# Altium schematic sheet LEDs.SchDoc
size B
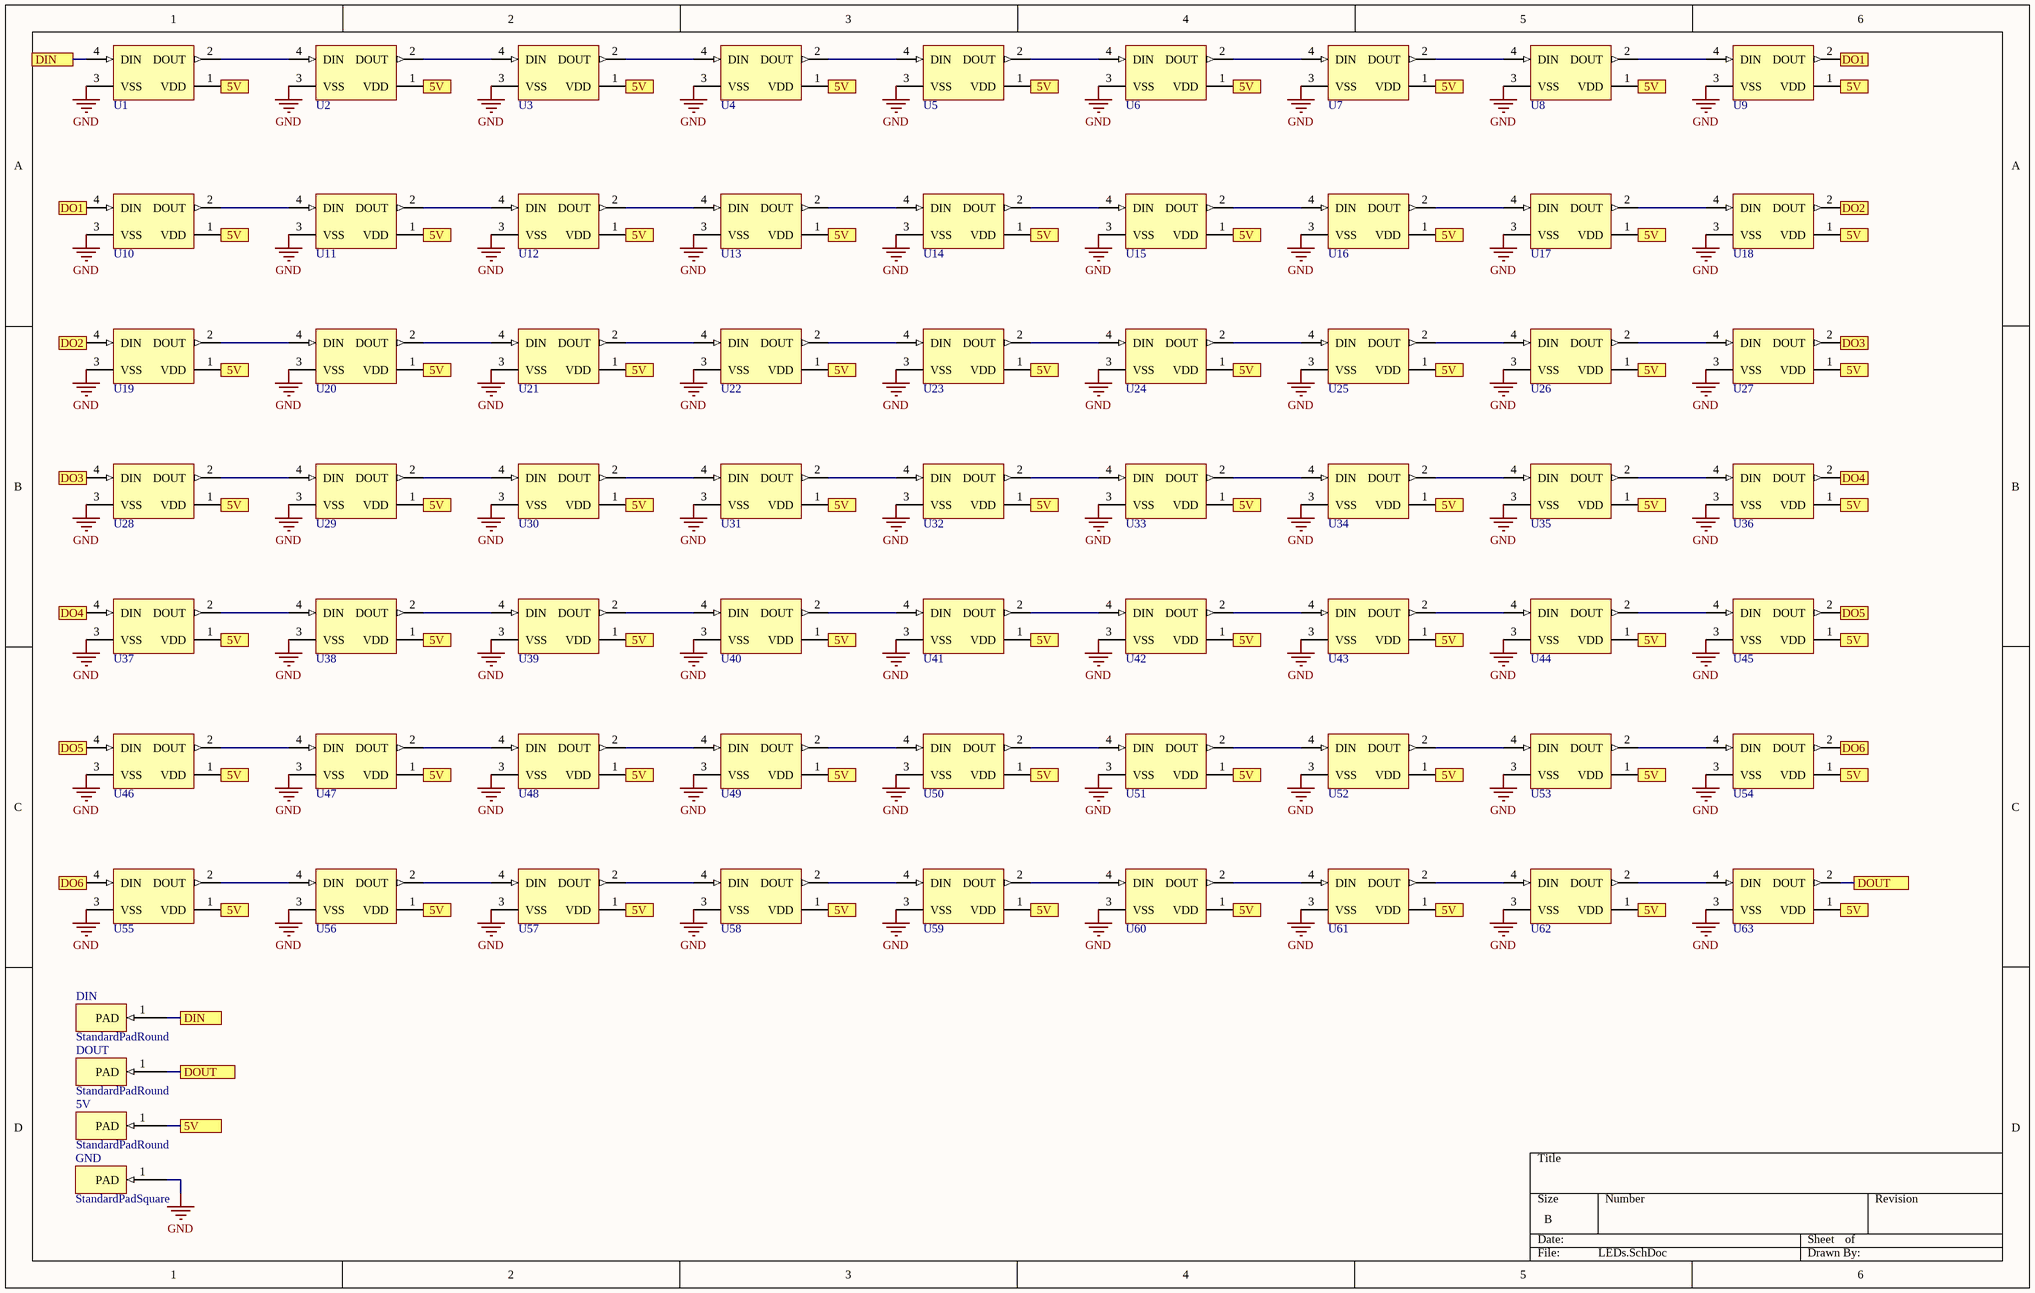
[diagram p0: LEDs.SchDoc]

## Parts
5V  StandardPadRound  [StandardPadRound-Footprint-1]
DIN  StandardPadRound  [StandardPadRound-Footprint-1]
DOUT  StandardPadRound  [StandardPadRound-Footprint-1]
GND  StandardPadSquare  [StandardPadSquare-Footprint-1]
U1  WS2812B  [WS2812B-Footprint-1]  (value not drawn)
U2  WS2812B  [WS2812B-Footprint-1]  (value not drawn)
U3  WS2812B  [WS2812B-Footprint-1]  (value not drawn)
U4  WS2812B  [WS2812B-Footprint-1]  (value not drawn)
U5  WS2812B  [WS2812B-Footprint-1]  (value not drawn)
U6  WS2812B  [WS2812B-Footprint-1]  (value not drawn)
U7  WS2812B  [WS2812B-Footprint-1]  (value not drawn)
U8  WS2812B  [WS2812B-Footprint-1]  (value not drawn)
U9  WS2812B  [WS2812B-Footprint-1]  (value not drawn)
U10  WS2812B  [WS2812B-Footprint-1]  (value not drawn)
U11  WS2812B  [WS2812B-Footprint-1]  (value not drawn)
U12  WS2812B  [WS2812B-Footprint-1]  (value not drawn)
U13  WS2812B  [WS2812B-Footprint-1]  (value not drawn)
U14  WS2812B  [WS2812B-Footprint-1]  (value not drawn)
U15  WS2812B  [WS2812B-Footprint-1]  (value not drawn)
U16  WS2812B  [WS2812B-Footprint-1]  (value not drawn)
U17  WS2812B  [WS2812B-Footprint-1]  (value not drawn)
U18  WS2812B  [WS2812B-Footprint-1]  (value not drawn)
U19  WS2812B  [WS2812B-Footprint-1]  (value not drawn)
U20  WS2812B  [WS2812B-Footprint-1]  (value not drawn)
U21  WS2812B  [WS2812B-Footprint-1]  (value not drawn)
U22  WS2812B  [WS2812B-Footprint-1]  (value not drawn)
U23  WS2812B  [WS2812B-Footprint-1]  (value not drawn)
U24  WS2812B  [WS2812B-Footprint-1]  (value not drawn)
U25  WS2812B  [WS2812B-Footprint-1]  (value not drawn)
U26  WS2812B  [WS2812B-Footprint-1]  (value not drawn)
U27  WS2812B  [WS2812B-Footprint-1]  (value not drawn)
U28  WS2812B  [WS2812B-Footprint-1]  (value not drawn)
U29  WS2812B  [WS2812B-Footprint-1]  (value not drawn)
U30  WS2812B  [WS2812B-Footprint-1]  (value not drawn)
U31  WS2812B  [WS2812B-Footprint-1]  (value not drawn)
U32  WS2812B  [WS2812B-Footprint-1]  (value not drawn)
U33  WS2812B  [WS2812B-Footprint-1]  (value not drawn)
U34  WS2812B  [WS2812B-Footprint-1]  (value not drawn)
U35  WS2812B  [WS2812B-Footprint-1]  (value not drawn)
U36  WS2812B  [WS2812B-Footprint-1]  (value not drawn)
U37  WS2812B  [WS2812B-Footprint-1]  (value not drawn)
U38  WS2812B  [WS2812B-Footprint-1]  (value not drawn)
U39  WS2812B  [WS2812B-Footprint-1]  (value not drawn)
U40  WS2812B  [WS2812B-Footprint-1]  (value not drawn)
U41  WS2812B  [WS2812B-Footprint-1]  (value not drawn)
U42  WS2812B  [WS2812B-Footprint-1]  (value not drawn)
U43  WS2812B  [WS2812B-Footprint-1]  (value not drawn)
U44  WS2812B  [WS2812B-Footprint-1]  (value not drawn)
U45  WS2812B  [WS2812B-Footprint-1]  (value not drawn)
U46  WS2812B  [WS2812B-Footprint-1]  (value not drawn)
U47  WS2812B  [WS2812B-Footprint-1]  (value not drawn)
U48  WS2812B  [WS2812B-Footprint-1]  (value not drawn)
U49  WS2812B  [WS2812B-Footprint-1]  (value not drawn)
U50  WS2812B  [WS2812B-Footprint-1]  (value not drawn)
U51  WS2812B  [WS2812B-Footprint-1]  (value not drawn)
U52  WS2812B  [WS2812B-Footprint-1]  (value not drawn)
U53  WS2812B  [WS2812B-Footprint-1]  (value not drawn)
U54  WS2812B  [WS2812B-Footprint-1]  (value not drawn)
U55  WS2812B  [WS2812B-Footprint-1]  (value not drawn)
U56  WS2812B  [WS2812B-Footprint-1]  (value not drawn)
U57  WS2812B  [WS2812B-Footprint-1]  (value not drawn)
U58  WS2812B  [WS2812B-Footprint-1]  (value not drawn)
U59  WS2812B  [WS2812B-Footprint-1]  (value not drawn)
U60  WS2812B  [WS2812B-Footprint-1]  (value not drawn)
U61  WS2812B  [WS2812B-Footprint-1]  (value not drawn)
U62  WS2812B  [WS2812B-Footprint-1]  (value not drawn)
U63  WS2812B  [WS2812B-Footprint-1]  (value not drawn)

## Ports
5V, DIN, DO1, DO2, DO3, DO4, DO5, DO6, DOUT

## Nets
GND: GND.1(PAD) U1.3(VSS) U2.3(VSS) U3.3(VSS) U4.3(VSS) U5.3(VSS) U6.3(VSS) U7.3(VSS) U8.3(VSS) U9.3(VSS) U10.3(VSS) U11.3(VSS) U12.3(VSS) U13.3(VSS) U14.3(VSS) U15.3(VSS) U16.3(VSS) U17.3(VSS) U18.3(VSS) U19.3(VSS) U20.3(VSS) U21.3(VSS) U22.3(VSS) U23.3(VSS) U24.3(VSS) U25.3(VSS) U26.3(VSS) U27.3(VSS) U28.3(VSS) U29.3(VSS) U30.3(VSS) U31.3(VSS) U32.3(VSS) U33.3(VSS) U34.3(VSS) U35.3(VSS) U36.3(VSS) U37.3(VSS) U38.3(VSS) U39.3(VSS) U40.3(VSS) U41.3(VSS) U42.3(VSS) U43.3(VSS) U44.3(VSS) U45.3(VSS) U46.3(VSS) U47.3(VSS) U48.3(VSS) U49.3(VSS) U50.3(VSS) U51.3(VSS) U52.3(VSS) U53.3(VSS) U54.3(VSS) U55.3(VSS) U56.3(VSS) U57.3(VSS) U58.3(VSS) U59.3(VSS) U60.3(VSS) U61.3(VSS) U62.3(VSS) U63.3(VSS)
5V: 5V.1(PAD) U1.1(VDD) U2.1(VDD) U3.1(VDD) U4.1(VDD) U5.1(VDD) U6.1(VDD) U7.1(VDD) U8.1(VDD) U9.1(VDD) U10.1(VDD) U11.1(VDD) U12.1(VDD) U13.1(VDD) U14.1(VDD) U15.1(VDD) U16.1(VDD) U17.1(VDD) U18.1(VDD) U19.1(VDD) U20.1(VDD) U21.1(VDD) U22.1(VDD) U23.1(VDD) U24.1(VDD) U25.1(VDD) U26.1(VDD) U27.1(VDD) U28.1(VDD) U29.1(VDD) U30.1(VDD) U31.1(VDD) U32.1(VDD) U33.1(VDD) U34.1(VDD) U35.1(VDD) U36.1(VDD) U37.1(VDD) U38.1(VDD) U39.1(VDD) U40.1(VDD) U41.1(VDD) U42.1(VDD) U43.1(VDD) U44.1(VDD) U45.1(VDD) U46.1(VDD) U47.1(VDD) U48.1(VDD) U49.1(VDD) U50.1(VDD) U51.1(VDD) U52.1(VDD) U53.1(VDD) U54.1(VDD) U55.1(VDD) U56.1(VDD) U57.1(VDD) U58.1(VDD) U59.1(VDD) U60.1(VDD) U61.1(VDD) U62.1(VDD) U63.1(VDD) ; port 5V
DIN: DIN.1(PAD) U1.4(DIN) ; port DIN
DO1: U9.2(DOUT) U10.4(DIN) ; port DO1
DO2: U18.2(DOUT) U19.4(DIN) ; port DO2
DO3: U27.2(DOUT) U28.4(DIN) ; port DO3
DO4: U36.2(DOUT) U37.4(DIN) ; port DO4
DO5: U45.2(DOUT) U46.4(DIN) ; port DO5
DO6: U54.2(DOUT) U55.4(DIN) ; port DO6
DOUT: DOUT.1(PAD) U63.2(DOUT) ; port DOUT
NetU1_2: U1.2(DOUT) U2.4(DIN)
NetU2_2: U2.2(DOUT) U3.4(DIN)
NetU3_2: U3.2(DOUT) U4.4(DIN)
NetU4_2: U4.2(DOUT) U5.4(DIN)
NetU5_2: U5.2(DOUT) U6.4(DIN)
NetU6_2: U6.2(DOUT) U7.4(DIN)
NetU7_2: U7.2(DOUT) U8.4(DIN)
NetU8_2: U8.2(DOUT) U9.4(DIN)
NetU10_2: U10.2(DOUT) U11.4(DIN)
NetU11_2: U11.2(DOUT) U12.4(DIN)
NetU12_2: U12.2(DOUT) U13.4(DIN)
NetU13_2: U13.2(DOUT) U14.4(DIN)
NetU14_2: U14.2(DOUT) U15.4(DIN)
NetU15_2: U15.2(DOUT) U16.4(DIN)
NetU16_2: U16.2(DOUT) U17.4(DIN)
NetU17_2: U17.2(DOUT) U18.4(DIN)
NetU19_2: U19.2(DOUT) U20.4(DIN)
NetU20_2: U20.2(DOUT) U21.4(DIN)
NetU21_2: U21.2(DOUT) U22.4(DIN)
NetU22_2: U22.2(DOUT) U23.4(DIN)
NetU23_2: U23.2(DOUT) U24.4(DIN)
NetU24_2: U24.2(DOUT) U25.4(DIN)
NetU25_2: U25.2(DOUT) U26.4(DIN)
NetU26_2: U26.2(DOUT) U27.4(DIN)
NetU28_2: U28.2(DOUT) U29.4(DIN)
NetU29_2: U29.2(DOUT) U30.4(DIN)
NetU30_2: U30.2(DOUT) U31.4(DIN)
NetU31_2: U31.2(DOUT) U32.4(DIN)
NetU32_2: U32.2(DOUT) U33.4(DIN)
NetU33_2: U33.2(DOUT) U34.4(DIN)
NetU34_2: U34.2(DOUT) U35.4(DIN)
NetU35_2: U35.2(DOUT) U36.4(DIN)
NetU37_2: U37.2(DOUT) U38.4(DIN)
NetU38_2: U38.2(DOUT) U39.4(DIN)
NetU39_2: U39.2(DOUT) U40.4(DIN)
NetU40_2: U40.2(DOUT) U41.4(DIN)
NetU41_2: U41.2(DOUT) U42.4(DIN)
NetU42_2: U42.2(DOUT) U43.4(DIN)
NetU43_2: U43.2(DOUT) U44.4(DIN)
NetU44_2: U44.2(DOUT) U45.4(DIN)
NetU46_2: U46.2(DOUT) U47.4(DIN)
NetU47_2: U47.2(DOUT) U48.4(DIN)
NetU48_2: U48.2(DOUT) U49.4(DIN)
NetU49_2: U49.2(DOUT) U50.4(DIN)
NetU50_2: U50.2(DOUT) U51.4(DIN)
NetU51_2: U51.2(DOUT) U52.4(DIN)
NetU52_2: U52.2(DOUT) U53.4(DIN)
NetU53_2: U53.2(DOUT) U54.4(DIN)
NetU55_2: U55.2(DOUT) U56.4(DIN)
NetU56_2: U56.2(DOUT) U57.4(DIN)
NetU57_2: U57.2(DOUT) U58.4(DIN)
NetU58_2: U58.2(DOUT) U59.4(DIN)
NetU59_2: U59.2(DOUT) U60.4(DIN)
NetU60_2: U60.2(DOUT) U61.4(DIN)
NetU61_2: U61.2(DOUT) U62.4(DIN)
NetU62_2: U62.2(DOUT) U63.4(DIN)

## Library data of the parts
5V DIN DOUT = CMP-000003-1: 1.9mm x 1.9mm round pad with a 1mm hole
GND = CMP-000004-1: 1.9mm X 1.9mm square pad with 1mm hole
U1-U63 = CMP-007-00035-2: Intelligent Control LED Integrated Light Source, 3.5 to 5.3 V, -25 to 80 degC, 4-Pin SMD, RoHS, Bulk; Manufacturer: Adafruit Industries; Mounting Technology: SM; Case/Package: WS2812B; Datasheet URL: https://cdn-shop.adafruit.com/datasheets/WS2812B.pdf; Manufacturer URL: https://www.adafruit.com/; Package Reference: WS2812B; Package Description: 4-Pin Surface Mount Device, Body 5 x 5 mm, Pitch 3.3 mm; RoHS Compliant: False; Datasheet Version: May-13